# Altium schematic sheet DAC PCM5102A.SchDoc
size A4
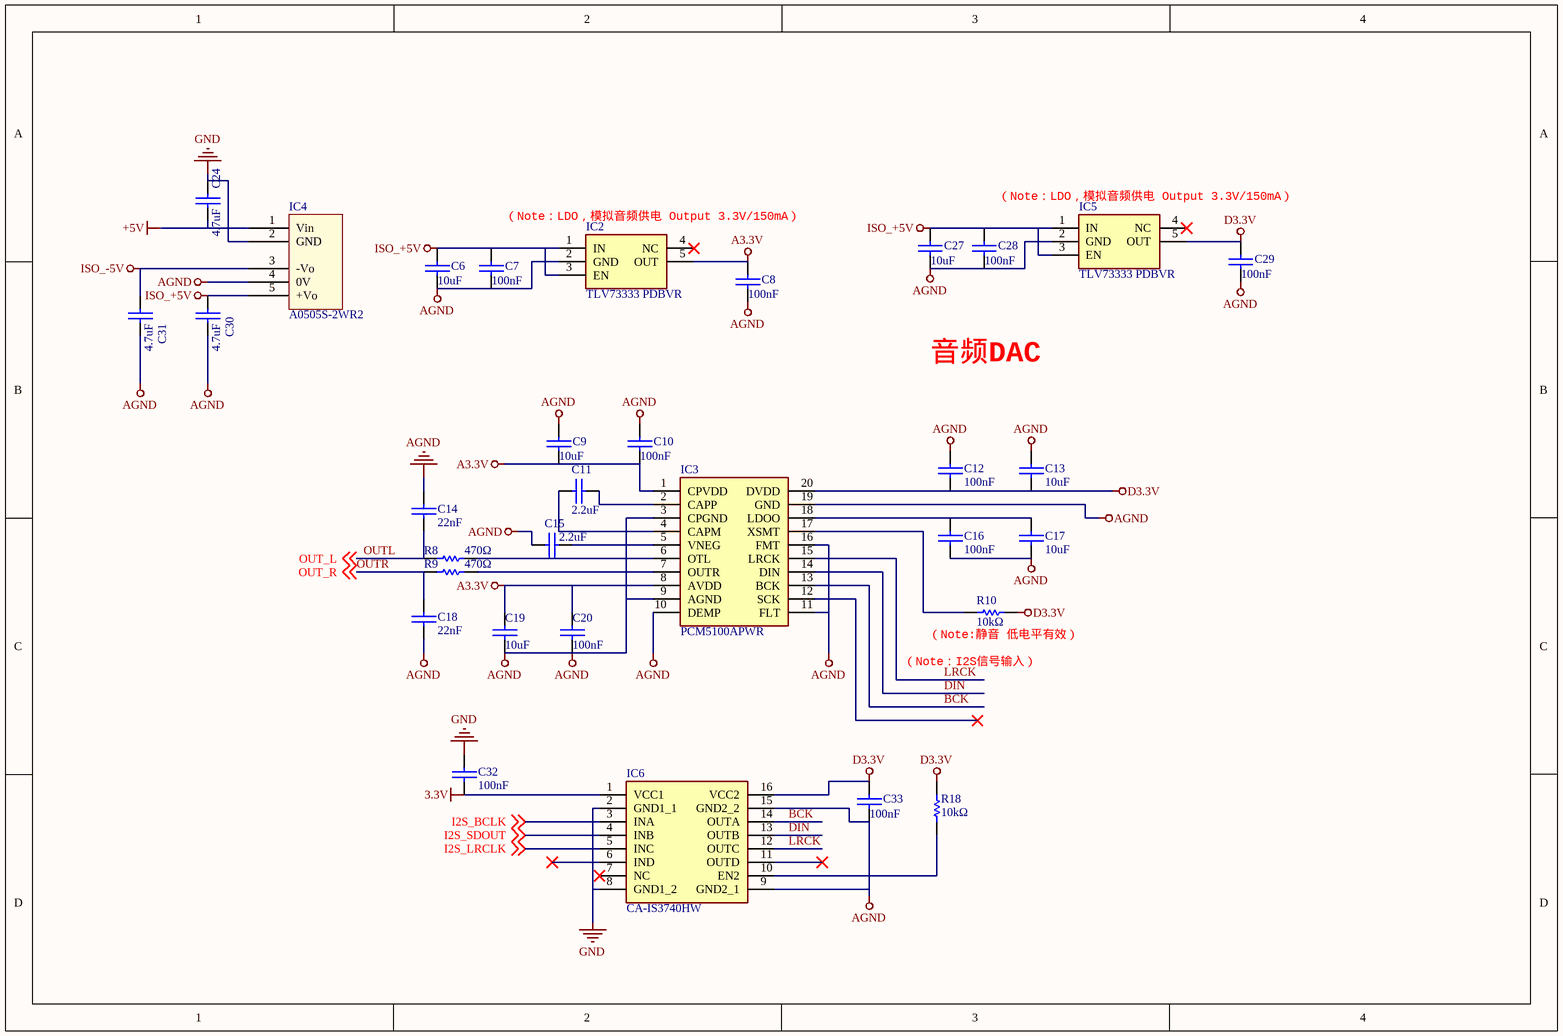
[diagram p0: DAC PCM5102A.SchDoc]

## Parts
C6  10uF  [C_0603]
C7  100nF  [C_0402]
C8  100nF  [C_0402]
C9  10uF  [C_0603]
C10  100nF  [C_0402]
C11  2.2uF  [C_0402]
C12  100nF  [C_0402]
C13  10uF  [C_0603]
C14  22nF  [C_0402]
C15  2.2uF  [C_0402]
C16  100nF  [C_0402]
C17  10uF  [C_0603]
C18  22nF  [C_0402]
C19  10uF  [C_0603]
C20  100nF  [C_0402]
C24  4.7uF  [C_0603]
C27  10uF  [C_0603]
C28  100nF  [C_0402]
C29  100nF  [C_0402]
C30  4.7uF  [C_0603]
C31  4.7uF  [C_0603]
C32  100nF  [C_0402]
C33  100nF  [C_0402]
IC2  TLV73333 PDBVR  [SOT95P280X145-5N]
IC3  PCM5100APWR  [SOP65P640X120-20N]
IC4  A0505S-2WR2  [B_S-2WR2]
IC5  TLV73333 PDBVR  [SOT95P280X145-5N]
IC6  CA-IS3740HW  [SOIC127P1030X265-16N]
R8  470Ω  [R_0402]
R9  470Ω  [R_0402]
R10  10kΩ  [R_0402]
R18  10kΩ  [R_0402]

## Nets
3.3V: C32.2 IC6.1(VCC1)
+5V: C24.2 IC4.1(Vin)
A3.3V: C8.2 C9.1 C10.1 C19.2 C20.2 IC2.5(OUT) IC3.1(CPVDD) IC3.8(AVDD)
AGND: C6.1 C7.1 C8.1 C9.2 C10.2 C12.2 C13.2 C14.2 C15.2 C16.1 C17.1 C18.1 C19.1 C20.1 C27.1 C28.1 C29.1 C30.2 C31.2 C33.1 IC2.2(GND) IC3.3(CPGND) IC3.9(AGND) IC3.10(DEMP) IC3.11(FLT) IC3.16(FMT) IC3.19(GND) IC4.4(0V) IC5.2(GND) IC6.9(GND2_1) IC6.15(GND2_2)
D3.3V: C12.1 C13.1 C29.2 C33.2 IC3.20(DVDD) IC5.5(OUT) IC6.16(VCC2) R10.1 R18.1
GND: C24.1 C32.1 IC4.2(GND) IC6.2(GND1_1) IC6.8(GND1_2)
ISO_+5V: C6.2 C7.2 C27.2 C28.2 C30.1 IC2.1(IN) IC2.3(EN) IC4.5(+Vo) IC5.1(IN) IC5.3(EN)
ISO_-5V: C31.1 IC4.3(-Vo)
BCK: IC3.13(BCK) IC6.14(OUTA)
DIN: IC3.14(DIN) IC6.13(OUTB)
I2S_BCLK: IC6.3(INA) ; off-sheet I2S_BCLK
I2S_LRCLK: IC6.5(INC) ; off-sheet I2S_LRCLK
I2S_SDOUT: IC6.4(INB) ; off-sheet I2S_SDOUT
LRCK: IC3.15(LRCK) IC6.12(OUTC)
OUTL: C14.1 R8.2 ; off-sheet OUT_L  [also labelled OUT_L]
OUTR: C18.2 R9.2 ; off-sheet OUT_R  [also labelled OUT_R]
NetC11_1: C11.1 IC3.2(CAPP)
NetC11_2: C11.2 IC3.4(CAPM)
NetC15_1: C15.1 IC3.5(VNEG)
NetC16_2: C16.2 C17.2 IC3.18(LDOO)
NetIC3_6: IC3.6(OTL) R8.1
NetIC3_7: IC3.7(OUTR) R9.1
NetIC3_17: IC3.17(XSMT) R10.2
NetIC6_10: IC6.10(EN2) R18.2

Not connected (* = marked no-connect by the designer): IC2 4(NC)*; IC3 12(SCK)*; IC5 4(NC)*; IC6 6(IND)* 7(NC)* 11(OUTD)*

## Notes on the sheet
- (near IC2) （Note：LDO，模拟音频供电 Output 3.3V/150mA）
- (near IC5) （Note：LDO，模拟音频供电 Output 3.3V/150mA）
- 音频DAC
- (near R10) （Note：I2S信号输入）
- (near R10) （Note:静音 低电平有效）

## Library data of the parts
C6-C20 C24 C27-C33 = Cap_Chip: 贴片电容; Manufacturer_Name: *; Manufacturer_Part_Number: *
IC2 IC5 = TLV71333PDBVR: LDO电源芯片; Manufacturer_Name: Texas Instruments; Manufacturer_Name_1: TECH PUBLIC(台舟); Manufacturer_Part_Number_1: TPTLV73333PDBVR; Manufacturer_Part_Number: TLV73333PDBVR; LCSC: C134139
IC3 = PCM5102APWR: 音频DAC; Manufacturer_Name: Texas Instruments; Manufacturer_Part_Number: PCM5100APWR; Manufacturer_Name_1: Texas Instruments; Manufacturer_Part_Number_1: PCM5102APWR
IC4 = B_S-2WR2: 隔离DC-DC; Manufacturer_Name: K-OUT; Manufacturer_Part_Number: A0505S-2WR2
IC6 = ISO7740FDW: IO隔离芯片; Manufacturer_Name: Chipanalog(川土); Manufacturer_Part_Number: CA-IS3740HW; LCSC: C528653
R8-R10 R18 = Res_Chip: 贴片电阻; Manufacturer_Name: *; Manufacturer_Part_Number: *